# EAGLE schematic V-00337-02 (EAGLE 7.2.0)
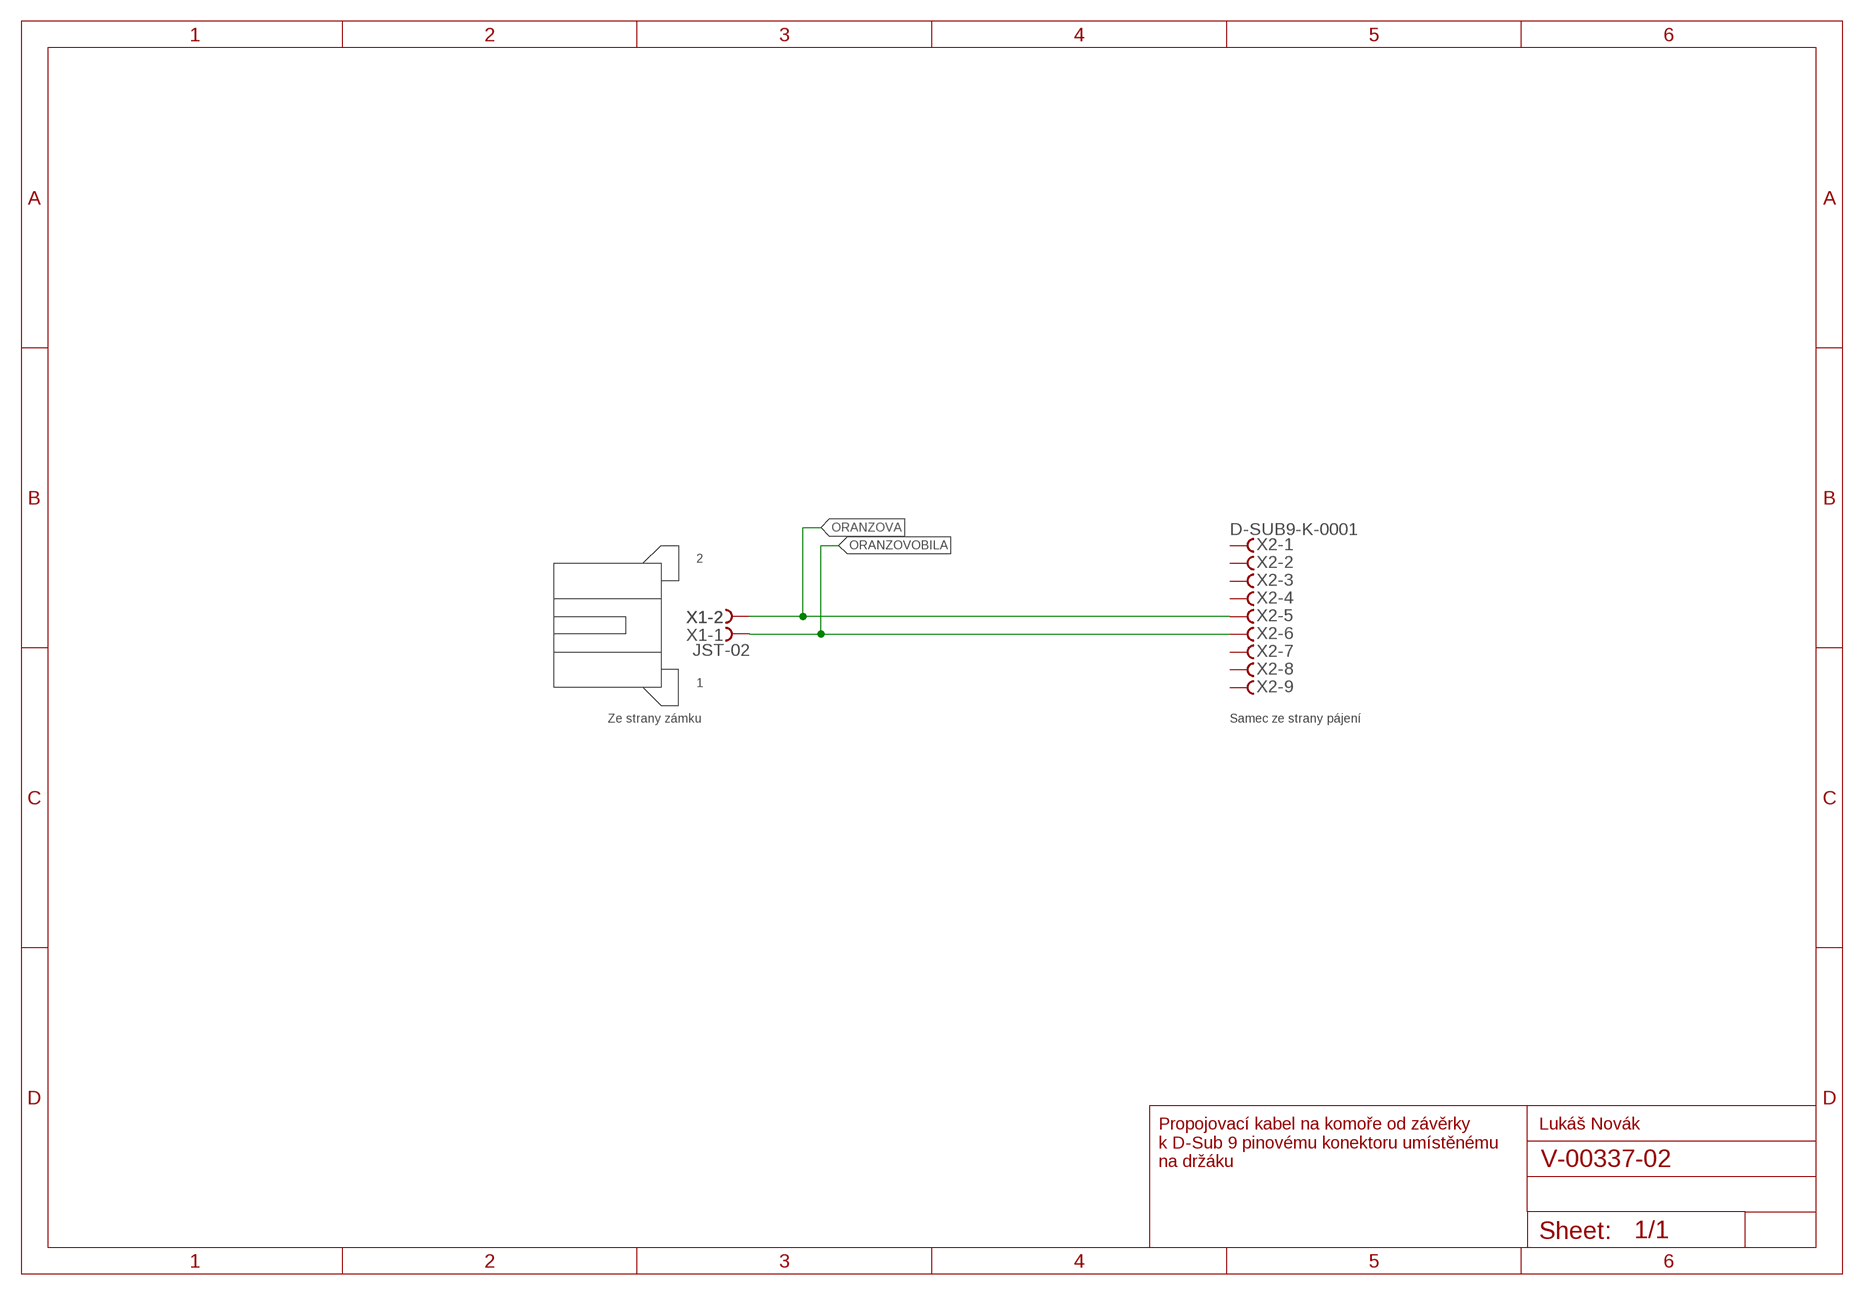
[diagram p0: schematic, sheet 1]

## Parts
X1  JST-02  [JST-02]
X2  D-SUB9-K-0001  D-SUB9-H2M09ST  [H2M09ST]

## Nets
ORANZOVA: X1.P$2 X2.5
ORANZOVOBILA: X1.P$1 X2.6
Unconnected: X2.1 X2.2 X2.3 X2.4 X2.7 X2.8 X2.9

## Notes on the sheet
- 2
- 1
- Ze strany zámku | Samec ze strany pájení
- Lukáš Novák
- Propojovací kabel na komoře od závěrky
  k D-Sub 9 pinovému konektoru umístěnému
  na držáku

## Library data of the parts
X1 = Kabely:JST-02
X2 = con-thomas-betts:D-SUB9-: D-Subminiatur Connector Source: Electronioc Interconnects European Edition 1998; OC_FARNELL: unknown; OC_NEWARK: unknown